# EAGLE schematic ledstripcarhud (EAGLE 6.4)
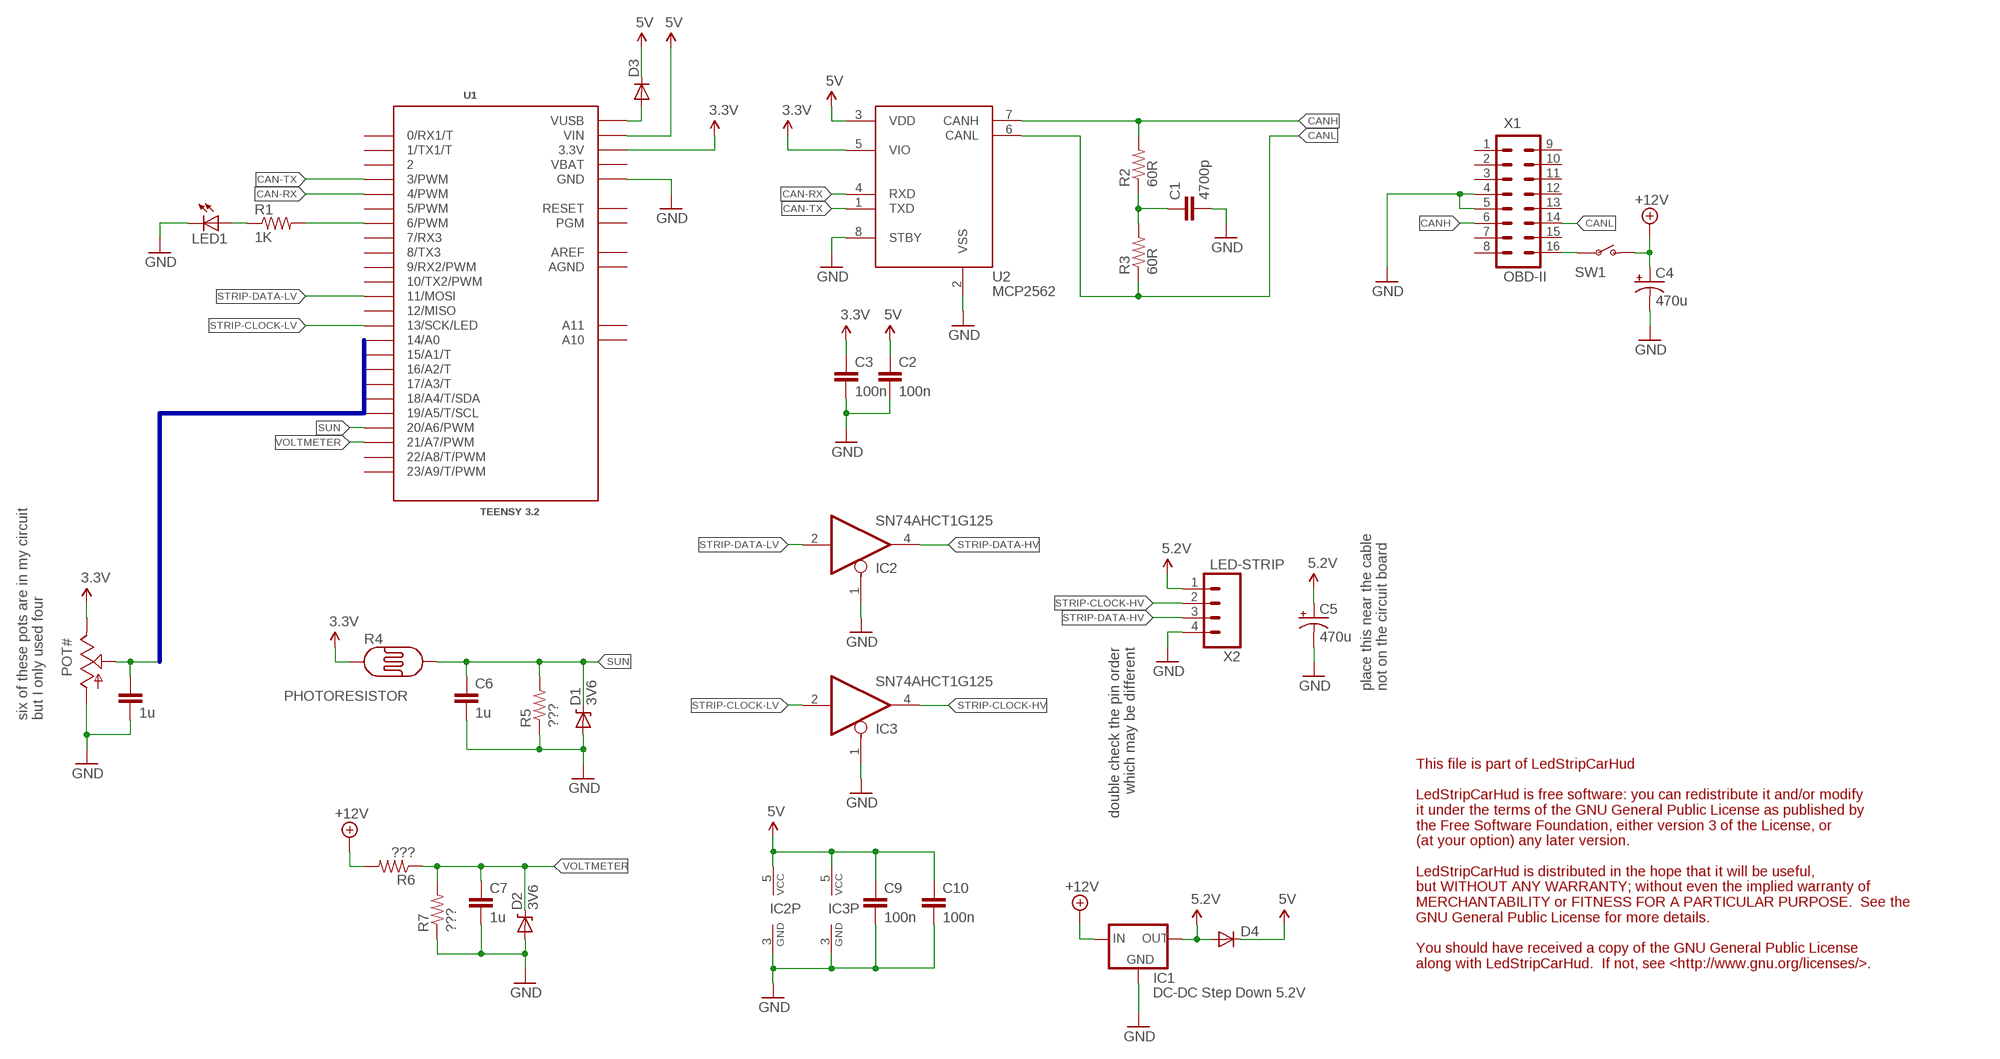
[diagram p0: schematic, sheet 1]

## Parts
C1  4700p  CAP0603-CAP  [0603-CAP]
C2  100n  CAP0603-CAP  [0603-CAP]
C3  100n  CAP0603-CAP  [0603-CAP]
C4  470u  CAP_POLE  [PANASONIC_E]
C5  470u  CAP_POLE  [PANASONIC_E]
C6  1u  CAP0603-CAP  [0603-CAP]
C7  1u  CAP0603-CAP  [0603-CAP]
C8  1u  CAP0603-CAP  [0603-CAP]
C9  100n  CAP0603-CAP  [0603-CAP]
C10  100n  CAP0603-CAP  [0603-CAP]
D1  3V6  DIODE-ZENER-BZT52  [SOD-323]
D2  3V6  DIODE-ZENER-BZT52  [SOD-323]
D3  DIODE1N4148  [DIODE-1N4148]
D4  DIODE1N4148  [DIODE-1N4148]
IC1  DC-DC Step Down 5.2V  V_REG_LD1117VXX  [78XXL]
IC2  SN74AHCT1G125  74AHC1G125DBV  [SOT23-5]
IC3  SN74AHCT1G125  74AHC1G125DBV  [SOT23-5]
LED1  LED3MM  [LED3MM]
POT#  POTTRIM  [TRIM_POT]
R1  1K  RESISTOR0603-RES  [0603-RES]
R2  60R  RESISTOR0603-RES  [0603-RES]
R3  60R  RESISTOR0603-RES  [0603-RES]
R4  PHOTORESISTOR  PHOTOCELLPTH  [PHOTOCELL]
R5  ???  RESISTOR0603-RES  [0603-RES]
R6  ???  RESISTOR0603-RES  [0603-RES]
R7  ???  RESISTOR0603-RES  [0603-RES]
SW1  SWITCH-SPST-2RA  [R_SW_TH]
U1  TEENSY 3.2  TEENSY_3.0_ALL_PINS  [TEENSY_3.0-3.2&LC_ALL_PINS]
U2  MCP2562  MCP2562-DIP8  [DIL08]
X1  OBD-II  M08X2  [2X8]
X2  LED-STRIP  M04PTH  [1X04]

## Nets
3.3V: C3.1 POT#.2(E) R4.1 U1.3.3V U1.3.3V1(3.3V) U2.5(VIO)
5V: C2.1 C5.+ C9.1 C10.1 D3.C D4.A D4.C IC1.GND(OUT) IC2.5(VCC) IC3.5(VCC) U1.VIN U2.3(VDD) X2.1 ; supply symbol labelled 5.2V
+12V: C4.+ IC1.OUT(IN) R6.2 SW1.P$3(O)
CAN-RX: U1.4(4/PWM) U2.4(RXD)
CAN-TX: U1.3(3/PWM) U2.1(TXD)
CANH: R2.2 U2.7(CANH) X1.6
CANL: R3.1 U2.6(CANL) X1.14
GND: C1.2 C2.2 C3.2 C4.- C5.- C6.2 C7.2 C8.2 C9.2 C10.2 D1.2(A) D2.2(A) IC1.IN(GND) IC2.1(OE) IC2.3(GND) IC3.1(OE) IC3.3(GND) LED1.K(C) POT#.3(A) R5.1 R7.1 U1.GND U1.GND1(GND) U2.2(VSS) U2.8(STBY) X1.4 X1.5 X2.4
N$1: R1.2 U1.6(6/PWM)
N$2: LED1.A R1.1
N$3: C8.1 POT#.1(S)
N$4: SW1.P$4(P) X1.16
N$5: D3.A U1.VUSB
N$6: C1.1 R2.1 R3.2
STRIP-CLOCK-HV: IC3.4(O) X2.2
STRIP-CLOCK-LV: IC3.2(I) U1.13(13/SCK/LED)
STRIP-DATA-HV: IC2.4(O) X2.3
STRIP-DATA-LV: IC2.2(I) U1.11(11/MOSI)
SUN: C6.1 D1.1(C) R4.2 R5.2 U1.20/A6(20/A6/PWM)
VOLTMETER: C7.1 D2.1(C) R6.1 R7.2 U1.21/A7(21/A7/PWM)
Unconnected: U1.0(0/RX1/T) U1.1(1/TX1/T) U1.2 U1.5(5/PWM) U1.7(7/RX3) U1.8(8/TX3) U1.9(9/RX2/PWM) U1.10(10/TX2/PWM) U1.12(12/MISO) U1.14/A0 U1.15/A1(15/A1/T) U1.16/A2(16/A2/T) U1.17/A3(17/A3/T) U1.18/A4(18/A4/T/SDA) U1.19/A5(19/A5/T/SCL) U1.22/A8(22/A8/T/PWM) U1.23/A9(23/A9/T/PWM) U1.A10 U1.A11 U1.PGM U1.RESET/DAC(RESET) X1.1 X1.2 X1.3 X1.7 X1.8 X1.9 X1.10 X1.11 X1.12 X1.13 X1.15

## Buses
B$1

## Notes on the sheet
- double check the pin order
  which may be different
- place this near the cable
  not on the circuit board
- six of these pots are in my circuit
  but I only used four
- This file is part of LedStripCarHud
  
  LedStripCarHud is free software: you can redistribute it and/or modify
  it under the terms of the GNU General Public License as published by
  the Free Software Foundation, either version 3 of the License, or
  (at your option) any later version.
  
  LedStripCarHud is distributed in the hope that it will be useful,
  but WITHOUT ANY WARRANTY; without even the implied warranty of
  MERCHANTABILITY or FITNESS FOR A PARTICULAR PURPOSE.  See the
  GNU General Public License for more details.
  
  You should have received a copy of the GNU General Public License
  along with LedStripCarHud.  If not, see <http://www.gnu.org/licenses/>.

## Power pins joined to a net without a drawn wire
AGND: U1.AGND
AREF: U1.AREF
VBAT: U1.VBAT

## Library data of the parts
C1-C3 C6-C10 = ledstripcarhud:CAP: Capacitor Standard 0603 ceramic capacitor, and 0.1" leaded capacitor.
C4 C5 = ledstripcarhud:CAP_POL: Capacitor Polarized These are standard SMD and PTH capacitors. Normally 10uF, 47uF, and 100uF in electrolytic and tantalum varieties. Always verify the external diameter of the through hole cap, it varies with capacity, voltage, and manufacturer. The EIA devices should be standard.
D1 D2 = ledstripcarhud:DIODE-ZENER: Zener Diode Production Part - 8199 3.4V Zener Voltage
D3 D4 = ledstripcarhud:DIODE: Diode These are standard reverse protection diodes and small signal diodes. SMA package can handle up to about 1A. SOD-323 can handle about 200mA. What the SOD-323 package when ordering, there are some mfgs out there that are 5-pin packages.
IC1 = ledstripcarhud:V_REG_LD1117VXX: LD1117VXX voltage regulator. We carry the 3.3V version (COM-00526) in TO-220 package.
IC2 IC3 = ledstripcarhud:74*1G125: Single Bus Buffer Gate with 3-State Output
LED1 = ledstripcarhud:LED: LEDs Standard schematic elements and footprints for 5mm, 3mm, 1206, and 0603 sized LEDs. 5mm - Spark Fun Electronics SKU : COM-00529 (and others)
POT# = ledstripcarhud:POT
R1-R3 R5-R7 = ledstripcarhud:RESISTOR: Resistor Basic schematic elements and footprints for 0603, 1206, and PTH resistors.
R4 = ledstripcarhud:PHOTOCELL: Photocell Also known as a CdS photoresistor. This is a low cost way to detect light levels. Resistance decreases with more incoming light. SparkFun SKU: SEN-09088
SW1 = ledstripcarhud:SWITCH-SPST-2
U1 = ledstripcarhud:TEENSY_3.0_ALL_PINS: Teensy 3.0 board, showing all pins that are easily acessible.
U2 = ledstripcarhud:MCP2562
X1 = ledstripcarhud:M08X2
X2 = ledstripcarhud:M04: Header 4 Standard 4-pin 0.1" header. Use with straight break away headers (SKU : PRT-00116), right angle break away headers (PRT-00553), swiss pins (PRT-00743), machine pins (PRT-00117), and female headers (PRT-00115). Molex polarized connector foot print use with SKU : PRT-08231 with associated crimp pins and housings. 1MM SMD Version SKU: PRT-10208